# Altium project Enigma Rev A.PrjPCB (part 10 of 10)
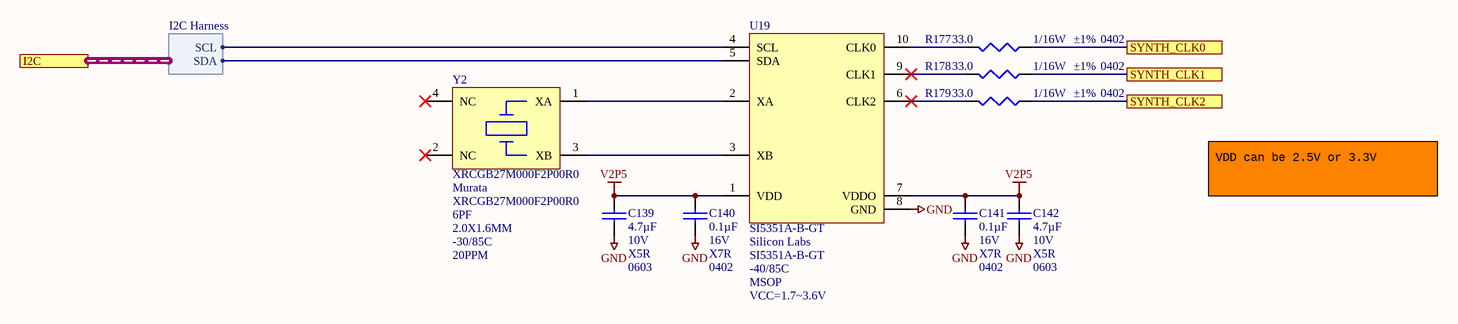
[diagram p20: Clock Synth.SchDoc]

## Nets that join several sheets
GND: Block Diagram (J29.8), Arduino and PMOD Connectors (16 pins), User Interface (22 pins), Snickerdoodle PS (24 pins), Snickerdoodle FPGA JA (22 pins), Snickerdoodle FPGA JB (24 pins), Snickerdoodle FPGA JC (12 pins), LCD (57 pins), USB Type C (40 pins), USB Type C Connector ESD (23 pins), USB Hub (41 pins), I2S Audio (26 pins), USB Phy (13 pins), FMC 400 Pin (164 pins), Power (6 pins), Battery Manager (32 pins), Power V12P0 (9 pins), Power Main Regulators (35 pins), Clock Synth (5 pins)
SNK_VIN: Snickerdoodle PS (C186.2 C188.2 J27.29 J27.30), Power (C144.2 U20.8)
USB_3V3: USB Type C (21 pins), USB Type C Connector ESD (C66.2 LED4.1 U8.10)
V1P8: Block Diagram (R1.1), User Interface (8 pins), Snickerdoodle PS (C185.2 J26.1 R68.1), USB Phy (8 pins)
V2P5: Block Diagram (J29.7), Snickerdoodle FPGA JC (5 pins), LCD (10 pins), Power Main Regulators (C165.2 L12.1 R199.1), Clock Synth (6 pins)
V3P3: Block Diagram (J29.5 R116.1 R117.1), Arduino and PMOD Connectors (16 pins), User Interface (5 pins), Snickerdoodle FPGA JA (8 pins), LCD (17 pins), USB Type C (C57.2 U4.53), USB Hub (13 pins), I2S Audio (9 pins), USB Phy (C115.2 C116.2 U15.4), FMC 400 Pin (5 pins), Power Main Regulators (C153.2 L10.1 R191.1)
V5P0: Block Diagram (J29.4), LCD (6 pins), USB Type C (C50.2 U4.14 U4.27 U4.28), USB Hub (9 pins), USB Phy (7 pins), Power Main Regulators (C147.2 L9.1 R187.1)
V12P0: Block Diagram (J29.3), FMC 400 Pin (J24.C35 J24.C37), Power V12P0 (C176.2 L13.1 R205.1)
VADJ: Block Diagram (J29.6), Snickerdoodle FPGA JB (5 pins), FMC 400 Pin (8 pins), Power Main Regulators (C159.2 L11.1 R195.1)
VBAT: Block Diagram (J29.2), USB Type C (C48.2 C49.2 U4.33 U4.34), Power (R182.1 R183.1), Battery Manager (8 pins)
VBUS: USB Type C (L2.1), USB Type C Connector ESD (9 pins)
VDDD_V3P3: Power (R180.2 R181.2), Power Main Regulators (8 pins)
VSYS: Block Diagram (J29.1), I2S Audio (9 pins), Power (C143.2 U20.1), Battery Manager (10 pins), Power V12P0 (C174.2 U22.2), Power Main Regulators (11 pins)
ALERT: Snickerdoodle FPGA JA (J5.37), Battery Manager (U1.14)
AUX_N: Snickerdoodle FPGA JA (J5.12), USB Type C (R226.2 U4.55)
AUX_P: Snickerdoodle FPGA JA (J5.14), USB Type C (R224.1 U4.54)
BTN_BOTTOM: User Interface (C12.2 R17.1), Snickerdoodle PS (J26.2)
BTN_LEFT: User Interface (C10.2 R14.1), Snickerdoodle PS (J26.7)
BTN_LEFT_SEL: User Interface (C5.2 R4.1), Snickerdoodle PS (J26.17)
BTN_LEFT_SHLDR: User Interface (C7.2 R8.1), Snickerdoodle PS (J26.19)
BTN_RIGHT: User Interface (C11.2 R15.1), Snickerdoodle PS (J26.5)
BTN_RIGHT_SEL: User Interface (C6.2 R5.1), Snickerdoodle PS (J26.11)
BTN_RIGHT_SHLDR: User Interface (C8.2 R9.1), Snickerdoodle PS (J26.12)
BTN_TOP: User Interface (C9.2 R11.1), Snickerdoodle PS (J26.13)
C_CC1: USB Type C (C44.2 R50.2 U4.13), USB Type C Connector ESD (U8.12)
C_CC2: USB Type C (C45.2 R54.2 U4.15), USB Type C Connector ESD (U8.11)
C_USB_B_N: USB Type C (U4.9), USB Type C Connector ESD (J18.B7 U8.16)
C_USB_B_P: USB Type C (U4.8), USB Type C Connector ESD (J18.B6 U8.17)
C_USB_T_N: USB Type C (U4.7), USB Type C Connector ESD (J18.A7 U8.19)
C_USB_T_P: USB Type C (U4.6), USB Type C Connector ESD (J18.A6 U8.20)
CLK0_M2C_N: Snickerdoodle FPGA JB (J6.35), FMC 400 Pin (J24.H5)
CLK0_M2C_P: Snickerdoodle FPGA JB (J6.37), FMC 400 Pin (J24.H4)
CLK1_M2C_N: Snickerdoodle FPGA JB (J10.35), FMC 400 Pin (J24.G3)
CLK1_M2C_P: Snickerdoodle FPGA JB (J10.37), FMC 400 Pin (J24.G2)
CLK2_BIDIR_N: Snickerdoodle FPGA JB (J6.38), FMC 400 Pin (J24.K5)
CLK2_BIDIR_P: Snickerdoodle FPGA JB (J6.36), FMC 400 Pin (J24.K4)
CLK_DIR: Snickerdoodle FPGA JB (J6.4), FMC 400 Pin (J24.B1)
DP1_TX0_N: Snickerdoodle FPGA JA (J5.38), USB Type C (C14.1)
DP1_TX0_P: Snickerdoodle FPGA JA (J5.36), USB Type C (C55.1)
DP1_TX1_N: Snickerdoodle FPGA JA (J5.32), USB Type C (C189.1)
DP1_TX1_P: Snickerdoodle FPGA JA (J5.30), USB Type C (C190.1)
DP1_TX2_N: Snickerdoodle FPGA JA (J5.26), USB Type C (C191.1)
DP1_TX2_P: Snickerdoodle FPGA JA (J5.24), USB Type C (C192.1)
DP1_TX3_N: Snickerdoodle FPGA JA (J5.20), USB Type C (C193.1)
DP1_TX3_P: Snickerdoodle FPGA JA (J5.18), USB Type C (C194.1)
DP_HPD: Snickerdoodle FPGA JA (J4.4), USB Type C (U4.26)
DR_MUTE_N: Snickerdoodle PS (J26.8), I2S Audio (R104.1 U5.22)
FMC_SCL: User Interface (U16.10), Snickerdoodle PS (J27.7 R219.2), I2S Audio (U5.8), FMC 400 Pin (J24.C30)
FMC_SDA: User Interface (U16.9), Snickerdoodle PS (J27.8 R220.2), I2S Audio (U5.7), FMC 400 Pin (J24.C31)
HP_DETECT_N: Snickerdoodle PS (J26.14), I2S Audio (J23.4 R103.2)
HS1_RX_N: USB Type C (U2.2), USB Type C Connector ESD (J18.B10 U6.2 U6.9)
HS1_RX_P: USB Type C (U2.1), USB Type C Connector ESD (J18.B11 U6.1 U6.10)
HS1_TX_N: USB Type C (U2.5), USB Type C Connector ESD (C61.2)
HS1_TX_P: USB Type C (U2.4), USB Type C Connector ESD (C60.2)
HS2_RX_N: USB Type C (U2.10), USB Type C Connector ESD (J18.A10 U7.4 U7.7)
HS2_RX_P: USB Type C (U2.9), USB Type C Connector ESD (J18.A11 U7.5 U7.6)
HS2_TX_N: USB Type C (U2.7), USB Type C Connector ESD (C58.2)
HS2_TX_P: USB Type C (U2.6), USB Type C Connector ESD (C59.2)
I2C_JC_SCL: Snickerdoodle FPGA JC (J25.39 R216.2), Clock Synth (U19.4)
I2C_JC_SDA: Snickerdoodle FPGA JC (J25.40 R215.2), Clock Synth (U19.5)
I2C_USB_IRQ_N: Snickerdoodle FPGA JA (J5.2), USB Type C (R67.2 U4.43)
I2C_USB_SCL: Snickerdoodle FPGA JA (J5.39 R210.2), USB Type C (U4.47)
I2C_USB_SDA: Snickerdoodle FPGA JA (J5.40 R211.2), USB Type C (U4.46)
INT_REG_EN: Power (R180.1 S10.1), Power V12P0 (U22.3), Power Main Regulators (U21.23)
LA00_CC_N: Snickerdoodle FPGA JB (J10.38), FMC 400 Pin (J24.G7)
LA00_CC_P: Snickerdoodle FPGA JB (J10.36), FMC 400 Pin (J24.G6)
LA01_CC_N: Snickerdoodle FPGA JB (J6.14), FMC 400 Pin (J24.G19)
LA01_CC_P: Snickerdoodle FPGA JB (J6.12), FMC 400 Pin (J24.G18)
LA02_N: Snickerdoodle FPGA JB (J10.29), FMC 400 Pin (J24.H14)
LA02_P: Snickerdoodle FPGA JB (J10.31), FMC 400 Pin (J24.H13)
LA03_N: Snickerdoodle FPGA JB (J10.23), FMC 400 Pin (J24.C15)
LA03_P: Snickerdoodle FPGA JB (J10.25), FMC 400 Pin (J24.C14)
LA04_N: Snickerdoodle FPGA JB (J10.17), FMC 400 Pin (J24.G16)
LA04_P: Snickerdoodle FPGA JB (J10.19), FMC 400 Pin (J24.G15)
LA05_N: Snickerdoodle FPGA JB (J10.11), FMC 400 Pin (J24.G10)
LA05_P: Snickerdoodle FPGA JB (J10.13), FMC 400 Pin (J24.G9)
LA06_N: Snickerdoodle FPGA JB (J10.5), FMC 400 Pin (J24.H11)
LA06_P: Snickerdoodle FPGA JB (J10.7), FMC 400 Pin (J24.H10)
LA07_N: Snickerdoodle FPGA JB (J10.32), FMC 400 Pin (J24.G13)
LA07_P: Snickerdoodle FPGA JB (J10.30), FMC 400 Pin (J24.G12)
LA08_N: Snickerdoodle FPGA JB (J10.26), FMC 400 Pin (J24.D12)
LA08_P: Snickerdoodle FPGA JB (J10.24), FMC 400 Pin (J24.D11)
LA09_N: Snickerdoodle FPGA JB (J10.20), FMC 400 Pin (J24.C11)
LA09_P: Snickerdoodle FPGA JB (J10.18), FMC 400 Pin (J24.C10)
LA10_N: Snickerdoodle FPGA JB (J10.14), FMC 400 Pin (J24.D9)
LA10_P: Snickerdoodle FPGA JB (J10.12), FMC 400 Pin (J24.D8)
LA11_N: Snickerdoodle FPGA JB (J10.8), FMC 400 Pin (J24.H8)
LA11_P: Snickerdoodle FPGA JB (J10.6), FMC 400 Pin (J24.H7)
LA12_N: Snickerdoodle FPGA JB (J6.32), FMC 400 Pin (J24.C19)
LA12_P: Snickerdoodle FPGA JB (J6.30), FMC 400 Pin (J24.C18)
LA13_N: Snickerdoodle FPGA JB (J6.26), FMC 400 Pin (J24.D18)
LA13_P: Snickerdoodle FPGA JB (J6.24), FMC 400 Pin (J24.D17)
LA14_N: Snickerdoodle FPGA JB (J6.20), FMC 400 Pin (J24.H17)
LA14_P: Snickerdoodle FPGA JB (J6.18), FMC 400 Pin (J24.H16)
LA15_N: Snickerdoodle FPGA JB (J6.5), FMC 400 Pin (J24.C23)
LA15_P: Snickerdoodle FPGA JB (J6.7), FMC 400 Pin (J24.C22)
LA16_N: Snickerdoodle FPGA JB (J6.23), FMC 400 Pin (J24.D21)
LA16_P: Snickerdoodle FPGA JB (J6.25), FMC 400 Pin (J24.D20)
LA17_CC_N: Snickerdoodle FPGA JB (J6.8), FMC 400 Pin (J24.D15)
LA17_CC_P: Snickerdoodle FPGA JB (J6.6), FMC 400 Pin (J24.D14)
LA18_CC_N: Snickerdoodle FPGA JB (J6.29), FMC 400 Pin (J24.H20)
LA18_CC_P: Snickerdoodle FPGA JB (J6.31), FMC 400 Pin (J24.H19)
LCD_BL_DIM: Snickerdoodle FPGA JA (J5.35), LCD (R167.2 U18.4)
LCD_CLK_N: Snickerdoodle FPGA JC (J25.30), LCD (C198.2)
LCD_CLK_P: Snickerdoodle FPGA JC (J25.32), LCD (C197.2)
LCD_PWR_EN: Snickerdoodle PS (J26.18), LCD (R153.2 U17.24)
LCD_TX0_N: Snickerdoodle FPGA JC (J25.24), LCD (C200.2)
LCD_TX0_P: Snickerdoodle FPGA JC (J25.26), LCD (C199.2)
LCD_TX1_N: Snickerdoodle FPGA JC (J25.18), LCD (C202.2)
LCD_TX1_P: Snickerdoodle FPGA JC (J25.20), LCD (C201.2)
LCD_TX2_N: Snickerdoodle FPGA JC (J25.12), LCD (C204.2)
LCD_TX2_P: Snickerdoodle FPGA JC (J25.14), LCD (C203.2)
LCD_TX3_N: Snickerdoodle FPGA JC (J25.7), LCD (C206.2)
LCD_TX3_P: Snickerdoodle FPGA JC (J25.5), LCD (C205.2)
LRCLK: Snickerdoodle FPGA JA (J5.5), I2S Audio (U5.16)
MCLK: Snickerdoodle FPGA JA (J5.8), I2S Audio (U5.13)
NetT2_1: Block Diagram (T2.1), Power Main Regulators (U21.41)
PG_C2M: Block Diagram (R117.2), FMC 400 Pin (J24.D1)
PG_M2C: Block Diagram (R116.2), FMC 400 Pin (J24.F1)
PMODA1: Arduino and PMOD Connectors (R118.1), Snickerdoodle FPGA JA (J5.11)
PMODA2: Arduino and PMOD Connectors (R120.1), Snickerdoodle FPGA JA (J5.17)
PMODA3: Arduino and PMOD Connectors (R122.1), Snickerdoodle FPGA JA (J5.23)
PMODA4: Arduino and PMOD Connectors (R124.1), Snickerdoodle FPGA JA (J5.29)
PMODA7: Arduino and PMOD Connectors (R119.2), Snickerdoodle FPGA JA (J5.13)
PMODA8: Arduino and PMOD Connectors (R121.2), Snickerdoodle FPGA JA (J5.19)
PMODA9: Arduino and PMOD Connectors (R123.2), Snickerdoodle FPGA JA (J5.25)
PMODA10: Arduino and PMOD Connectors (R125.2), Snickerdoodle FPGA JA (J5.31)
PMODB1: Arduino and PMOD Connectors (R126.1), Snickerdoodle FPGA JA (J4.23)
PMODB2: Arduino and PMOD Connectors (R128.1), Snickerdoodle FPGA JA (J4.29)
PMODB3: Arduino and PMOD Connectors (R130.1), Snickerdoodle FPGA JA (J4.35)
PMODB4: Arduino and PMOD Connectors (R132.1), Snickerdoodle FPGA JA (J4.38)
PMODB7: Arduino and PMOD Connectors (R127.2), Snickerdoodle FPGA JA (J4.25)
PMODB8: Arduino and PMOD Connectors (R129.2), Snickerdoodle FPGA JA (J4.31)
PMODB9: Arduino and PMOD Connectors (R131.2), Snickerdoodle FPGA JA (J4.37)
PMODB10: Arduino and PMOD Connectors (R133.2), Snickerdoodle FPGA JA (J4.36)
PMODC1: Arduino and PMOD Connectors (R134.1), Snickerdoodle FPGA JA (J4.8)
PMODC2: Arduino and PMOD Connectors (R136.1), Snickerdoodle FPGA JA (J4.5)
PMODC3: Arduino and PMOD Connectors (R138.1), Snickerdoodle FPGA JA (J4.11)
PMODC4: Arduino and PMOD Connectors (R140.1), Snickerdoodle FPGA JA (J4.17)
PMODC7: Arduino and PMOD Connectors (R135.2), Snickerdoodle FPGA JA (J4.6)
PMODC8: Arduino and PMOD Connectors (R137.2), Snickerdoodle FPGA JA (J4.7)
PMODC9: Arduino and PMOD Connectors (R139.2), Snickerdoodle FPGA JA (J4.13)
PMODC10: Arduino and PMOD Connectors (R141.2), Snickerdoodle FPGA JA (J4.19)
PMODD1: Arduino and PMOD Connectors (R142.1), Snickerdoodle FPGA JA (J4.32)
PMODD2: Arduino and PMOD Connectors (R144.1), Snickerdoodle FPGA JA (J4.26)
PMODD3: Arduino and PMOD Connectors (R146.1), Snickerdoodle FPGA JA (J4.20)
PMODD4: Arduino and PMOD Connectors (R148.1), Snickerdoodle FPGA JA (J4.14)
PMODD7: Arduino and PMOD Connectors (R143.2), Snickerdoodle FPGA JA (J4.30)
PMODD8: Arduino and PMOD Connectors (R145.2), Snickerdoodle FPGA JA (J4.24)
PMODD9: Arduino and PMOD Connectors (R147.2), Snickerdoodle FPGA JA (J4.18)
PMODD10: Arduino and PMOD Connectors (R149.2), Snickerdoodle FPGA JA (J4.12)
PRSNT_M2C_L: Block Diagram (R1.2), Snickerdoodle PS (J26.20), FMC 400 Pin (J24.H2)
S_SBU_N: USB Type C (R66.2 R72.1 U4.11), USB Type C Connector ESD (U8.14)
S_SBU_P: USB Type C (R65.2 R71.1 U4.10), USB Type C Connector ESD (U8.15)
SCLK: Snickerdoodle FPGA JA (J5.6), I2S Audio (U5.14)
SDIN: Snickerdoodle FPGA JA (J5.4), I2S Audio (U5.15)
SPKR_SHTDWN_N: Snickerdoodle PS (J26.6), I2S Audio (R100.2 U5.6)
SYNTH_CLK0: Snickerdoodle FPGA JC (J25.8), Clock Synth (R177.2)
SYNTH_CLK1: Snickerdoodle FPGA JC (J25.36), Clock Synth (R178.2)
SYNTH_CLK2: Snickerdoodle FPGA JC (J25.6), Clock Synth (R179.2)
TFT_RESET: Snickerdoodle FPGA JA (J5.7), LCD (J16.5 Q11.1 R151.2)
TOUCH_INT_N: Snickerdoodle FPGA JA (J4.2), LCD (J11.5)
TOUCH_SCL: Snickerdoodle FPGA JA (J4.39 R208.2), LCD (J11.3), Battery Manager (U1.17), Power Main Regulators (U21.43)
TOUCH_SDA: Snickerdoodle FPGA JA (J4.40 R209.2), LCD (J11.2), Battery Manager (U1.16), Power Main Regulators (U21.42)
ULPI_CLK: Snickerdoodle PS (J26.35), USB Phy (U15.12)
ULPI_D0: Snickerdoodle PS (J26.29), USB Phy (U15.16)
ULPI_D1: Snickerdoodle PS (J26.31), USB Phy (U15.15)
ULPI_D2: Snickerdoodle PS (J26.32), USB Phy (U15.14)
ULPI_D3: Snickerdoodle PS (J26.30), USB Phy (U15.13)
ULPI_D4: Snickerdoodle PS (J26.23), USB Phy (U15.11)
ULPI_D5: Snickerdoodle PS (J26.37), USB Phy (U15.10)
ULPI_D6: Snickerdoodle PS (J26.38), USB Phy (U15.9)
ULPI_D7: Snickerdoodle PS (J26.36), USB Phy (U15.8)
ULPI_DIR: Snickerdoodle PS (J26.25), USB Phy (U15.19)
ULPI_NXT: Snickerdoodle PS (J26.24), USB Phy (U15.18)
ULPI_RST_N: Snickerdoodle PS (J26.4), USB Hub (U9.4), USB Phy (R176.1 U15.22)
ULPI_STP: Snickerdoodle PS (J26.26), USB Phy (U15.20)
USB_2P0_N: USB Type C (U4.5), USB Hub (R86.2 R94.2)
USB_2P0_P: USB Type C (U4.4), USB Hub (R85.2 R93.2)
USB_HOST_N: USB Hub (R83.1), USB Phy (U15.5)
USB_HOST_P: USB Hub (R78.2 R81.1), USB Phy (U15.6)

## Assembly variants
DEFAULT: not fitted C195 C196 J3 J9 J17 J28 J29 R223 R224 R225 R226